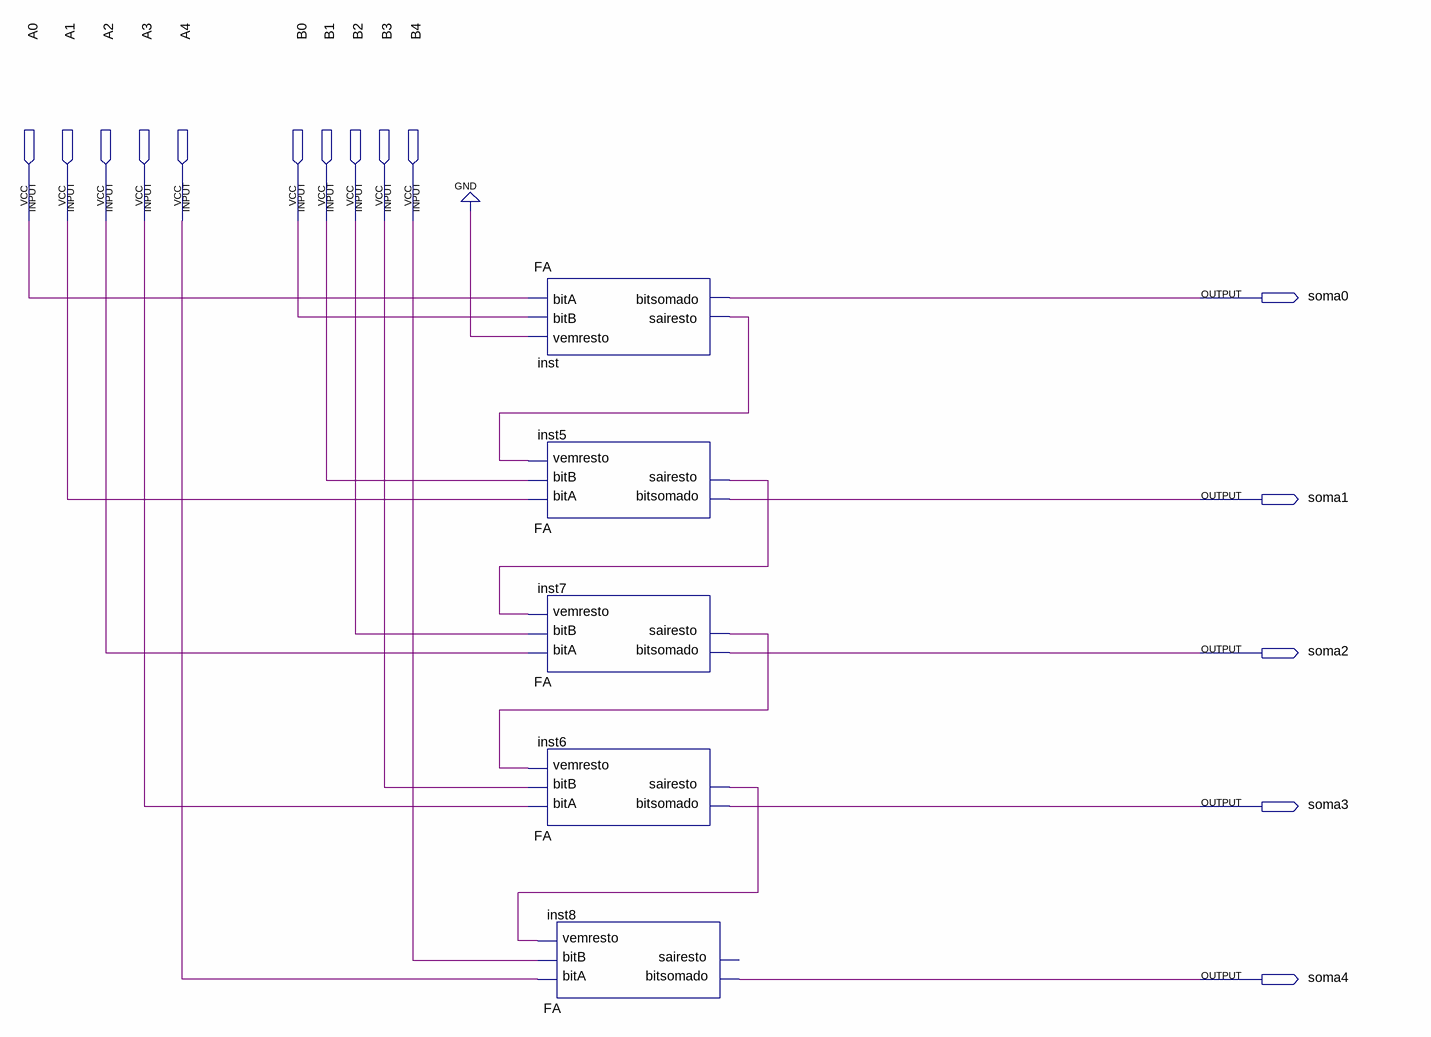
[diagram p0: schematic sheet]
// Quartus schematic somador_bit_a_bit.bdf as structural Verilog: 5 symbols, 15 pins
module somador_bit_a_bit (
  input  A0,
  input  A1,
  input  A2,
  input  A3,
  input  A4,
  input  B0,
  input  B1,
  input  B2,
  input  B3,
  input  B4,
  output soma0,
  output soma1,
  output soma2,
  output soma3,
  output soma4
);

  wire inst5_sairesto, inst6_sairesto, inst7_sairesto, inst_sairesto;

  FA inst (.bitA(A0), .bitB(B0), .vemresto(1'b0), .bitsomado(soma0), .sairesto(inst_sairesto));
  FA inst5 (.bitA(A1), .bitB(B1), .vemresto(inst_sairesto), .bitsomado(soma1), .sairesto(inst5_sairesto));
  FA inst7 (.bitA(A2), .bitB(B2), .vemresto(inst5_sairesto), .bitsomado(soma2), .sairesto(inst7_sairesto));
  FA inst6 (.bitA(A3), .bitB(B3), .vemresto(inst7_sairesto), .bitsomado(soma3), .sairesto(inst6_sairesto));
  FA inst8 (.bitA(A4), .bitB(B4), .vemresto(inst6_sairesto), .bitsomado(soma4));  // open: sairesto
endmodule
